# EasyEDA schematic 4017 simple sequencer v2.json
TITLE: sequencer v1; REV: 1.0; Date: 2021-01-03; Sheet: 1/1; Drawn By: unfirth; Company: T.O.P. BRAND ELECTRONICS
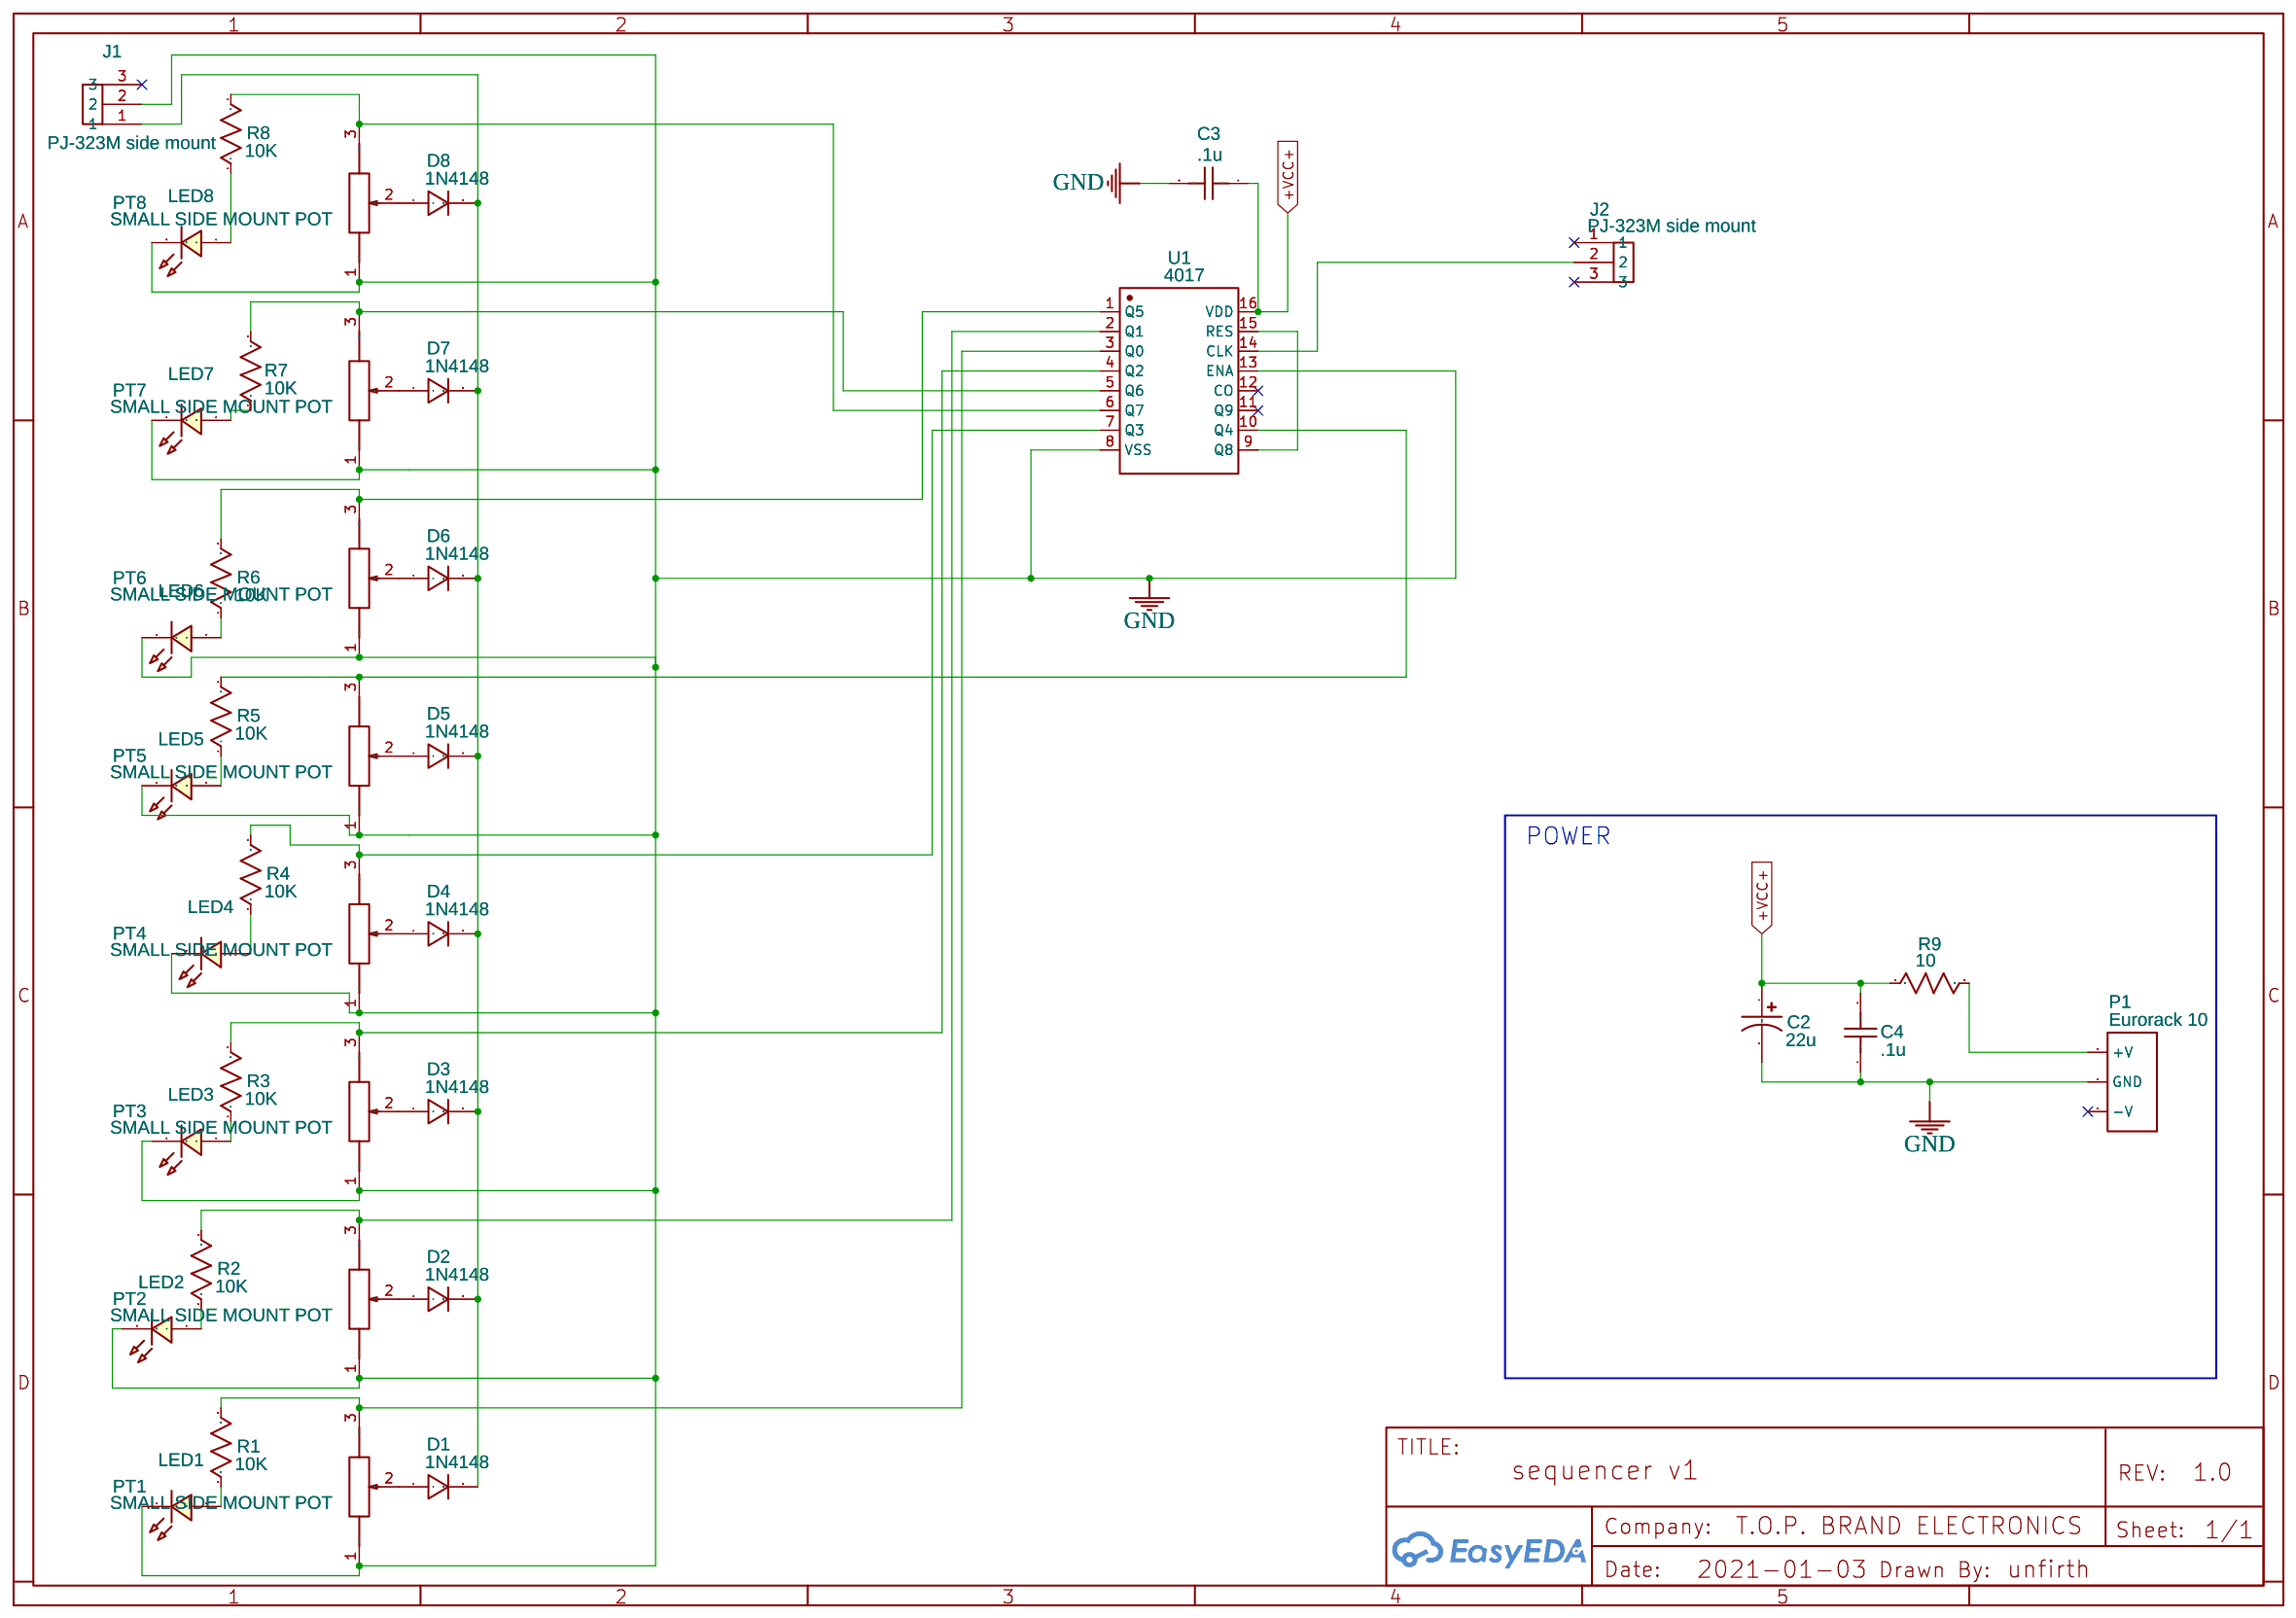
[diagram p0: schematic sheet]

## Parts
C2  22u  [CAP-D5.0×F2.0]
C3  .1u  [RAD-0.1]
C4  .1u  [RAD-0.1]
D1  1N4148  [DO-35_BD2.0-L4.0-P8.00-D0.5-FD]
D2  1N4148  [DO-35_BD2.0-L4.0-P8.00-D0.5-FD]
D3  1N4148  [DO-35_BD2.0-L4.0-P8.00-D0.5-FD]
D4  1N4148  [DO-35_BD2.0-L4.0-P8.00-D0.5-FD]
D5  1N4148  [DO-35_BD2.0-L4.0-P8.00-D0.5-FD]
D6  1N4148  [DO-35_BD2.0-L4.0-P8.00-D0.5-FD]
D7  1N4148  [DO-35_BD2.0-L4.0-P8.00-D0.5-FD]
D8  1N4148  [DO-35_BD2.0-L4.0-P8.00-D0.5-FD]
J1  PJ-323M side mount  [PJ-323M SIDE MOUNT]
J2  PJ-323M side mount  [PJ-323M SIDE MOUNT]
LED1  LED-TH-3mm_B  [LED-TH_BD3.0_BLUE]
LED2  LED-TH-3mm_B  [LED-TH_BD3.0_BLUE]
LED3  LED-TH-3mm_B  [LED-TH_BD3.0_BLUE]
LED4  LED-TH-3mm_B  [LED-TH_BD3.0_BLUE]
LED5  LED-TH-3mm_B  [LED-TH_BD3.0_BLUE]
LED6  LED-TH-3mm_B  [LED-TH_BD3.0_BLUE]
LED7  LED-TH-3mm_B  [LED-TH_BD3.0_BLUE]
LED8  LED-TH-3mm_B  [LED-TH_BD3.0_BLUE]
P1  Eurorack 10  [EURORACK HDR-IDC-2.54-2X5P]
PT1  SMALL SIDE MOUNT POT  [SMALL SIDE MOUNT POT]
PT2  SMALL SIDE MOUNT POT  [SMALL SIDE MOUNT POT]
PT3  SMALL SIDE MOUNT POT  [SMALL SIDE MOUNT POT]
PT4  SMALL SIDE MOUNT POT  [SMALL SIDE MOUNT POT]
PT5  SMALL SIDE MOUNT POT  [SMALL SIDE MOUNT POT]
PT6  SMALL SIDE MOUNT POT  [SMALL SIDE MOUNT POT]
PT7  SMALL SIDE MOUNT POT  [SMALL SIDE MOUNT POT]
PT8  SMALL SIDE MOUNT POT  [SMALL SIDE MOUNT POT]
R1  10K  [R_AXIAL-0.5]
R2  10K  [R_AXIAL-0.5]
R3  10K  [R_AXIAL-0.5]
R4  10K  [R_AXIAL-0.5]
R5  10K  [R_AXIAL-0.5]
R6  10K  [R_AXIAL-0.5]
R7  10K  [R_AXIAL-0.5]
R8  10K  [R_AXIAL-0.5]
R9  10  [R_AXIAL-0.5]
U1  4017  [DIP16]

## Library data of the parts
C2 = CE_TH_D5.0×F2.0_US: Contributor: LCEDA_Lib
C3 C4 = C_RAD-0.1_US: Contributor: LCEDA_Lib
D1-D8 = 1N4148: Supplier: LCSC; Manufacturer: SEMTECH; Supplier Part: C14516; Contributor: LCEDA_Lib
J1 J2 = PJ-323M side mount: Manufacturer: Tayda; Manufacturer Part: PJ-323M; Supplier: Mouser; Supplier Part: PJ-323M; Contributor: unfirth
LED1-LED8 = LED-TH-3mm_B: Manufacturer: EVERLIGHT(台湾亿光); Manufacturer Part: 204-10SUBC/S400-A4; Supplier Part: C86881; Supplier: LCSC; Contributor: LCEDA_Lib
P1 = Eurorack 2x5p 2.54mm: Supplier: LCSC; Manufacturer: BOOMELE; Manufacturer Part: IDC Box 2.54mm 2X5P; image: //image.lceda.cn/szlcsc/C5665.jpg; Supplier Part: C5665; Contributor: kalymnos77
PT1-PT8 = SMALL SIDE MOUNT POT: Contributor: unfirth
R1-R9 = R_AXIAL-0.5_US: Contributor: LCEDA_Lib
U1 = 4017

## Nets
+VCC+: C2.1 C3.1 C4.2 R9.1 U1.16(VDD)
GND: C2.2 C3.2 C4.1 J1.2 LED1.2 LED2.2 LED3.2 LED4.2 LED5.2 LED6.2 LED7.2 LED8.2 P1.2(GND) PT1.1 PT2.1 PT3.1 PT4.1 PT5.1 PT6.1 PT7.1 PT8.1 U1.8(VSS) U1.13(ENA)
Net-(D1-1): D1.1 PT1.2
Net-(D1-2): D1.2 D2.2 D3.2 D4.2 D5.2 D6.2 D7.2 D8.2 J1.1
Net-(D2-1): D2.1 PT2.2
Net-(D3-1): D3.1 PT3.2
Net-(D4-1): D4.1 PT4.2
Net-(D5-1): D5.1 PT5.2
Net-(D6-1): D6.1 PT6.2
Net-(D7-1): D7.1 PT7.2
Net-(D8-1): D8.1 PT8.2
Net-(J2-2): J2.2 U1.14(CLK)
Net-(LED1-1): LED1.1 R1.1
Net-(LED2-1): LED2.1 R2.1
Net-(LED3-1): LED3.1 R3.1
Net-(LED4-1): LED4.1 R4.1
Net-(LED5-1): LED5.1 R5.1
Net-(LED6-1): LED6.1 R6.1
Net-(LED7-1): LED7.1 R7.1
Net-(LED8-1): LED8.1 R8.1
Net-(P1-3): P1.3(+V) R9.2
Net-(PT1-3): PT1.3 R1.2 U1.3(Q0)
Net-(PT2-3): PT2.3 R2.2 U1.2(Q1)
Net-(PT3-3): PT3.3 R3.2 U1.4(Q2)
Net-(PT4-3): PT4.3 R4.2 U1.7(Q3)
Net-(PT5-3): PT5.3 R5.2 U1.10(Q4)
Net-(PT6-3): PT6.3 R6.2 U1.1(Q5)
Net-(PT7-3): PT7.3 R7.2 U1.5(Q6)
Net-(PT8-3): PT8.3 R8.2 U1.6(Q7)
Net-(U1-9): U1.9(Q8) U1.15(RES)

Not connected (* = marked no-connect by the designer): J1 3*; J2 1* 3*; P1 1(-V)*; U1 11(Q9)* 12(CO)*

## Notes on the sheet
- POWER
